# Altium schematic sheet esp32v4.SchDoc
size A2; SheetNumber: 2; SheetTotal: 2
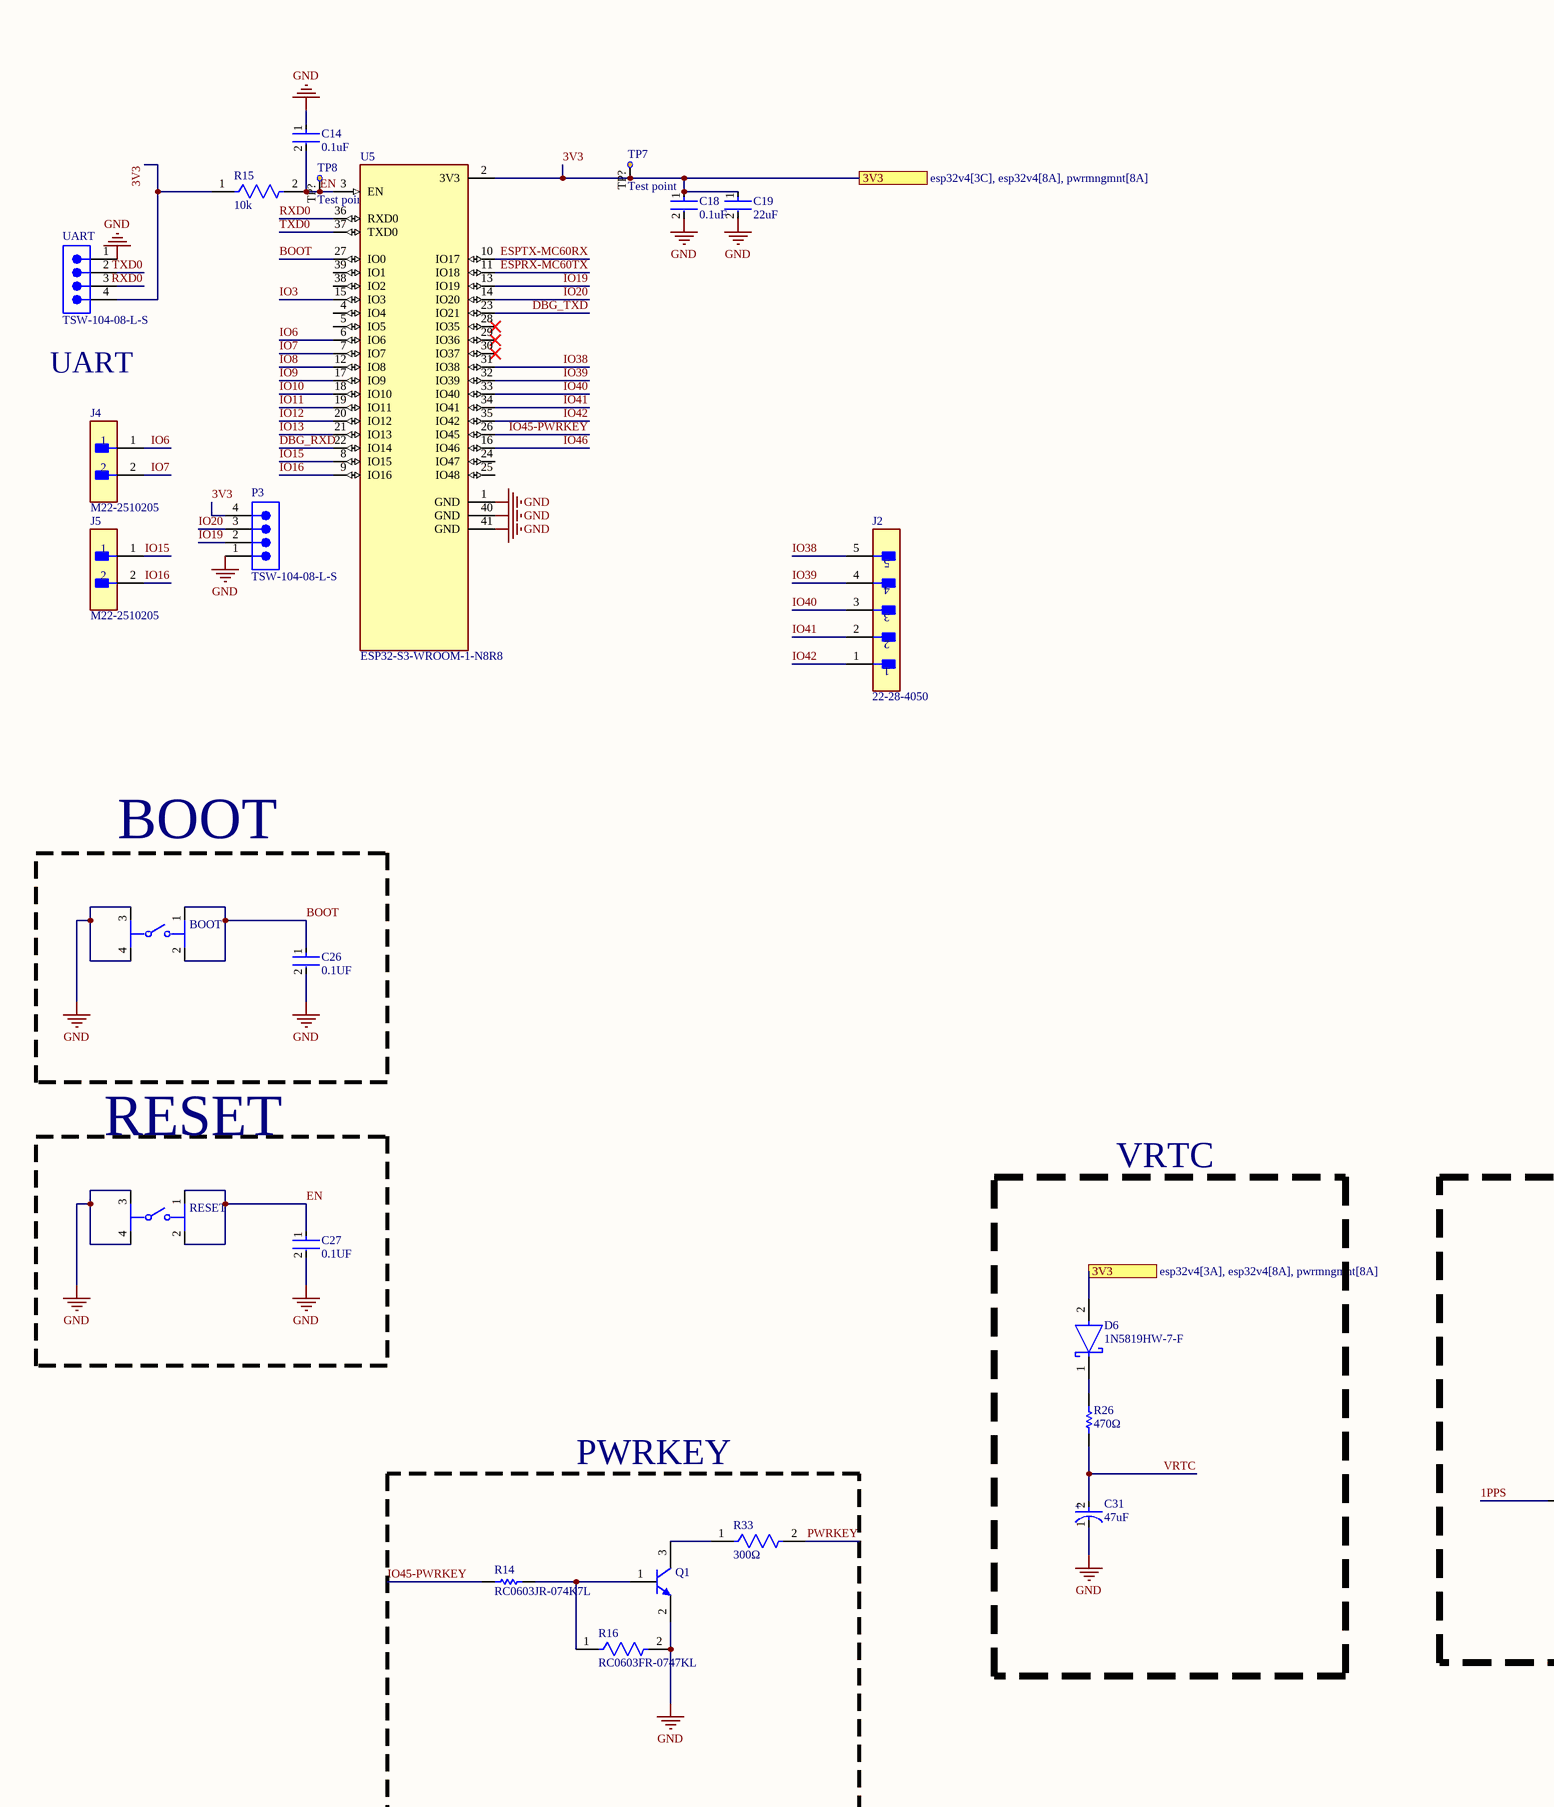
[diagram p0: esp32v4.SchDoc, left]
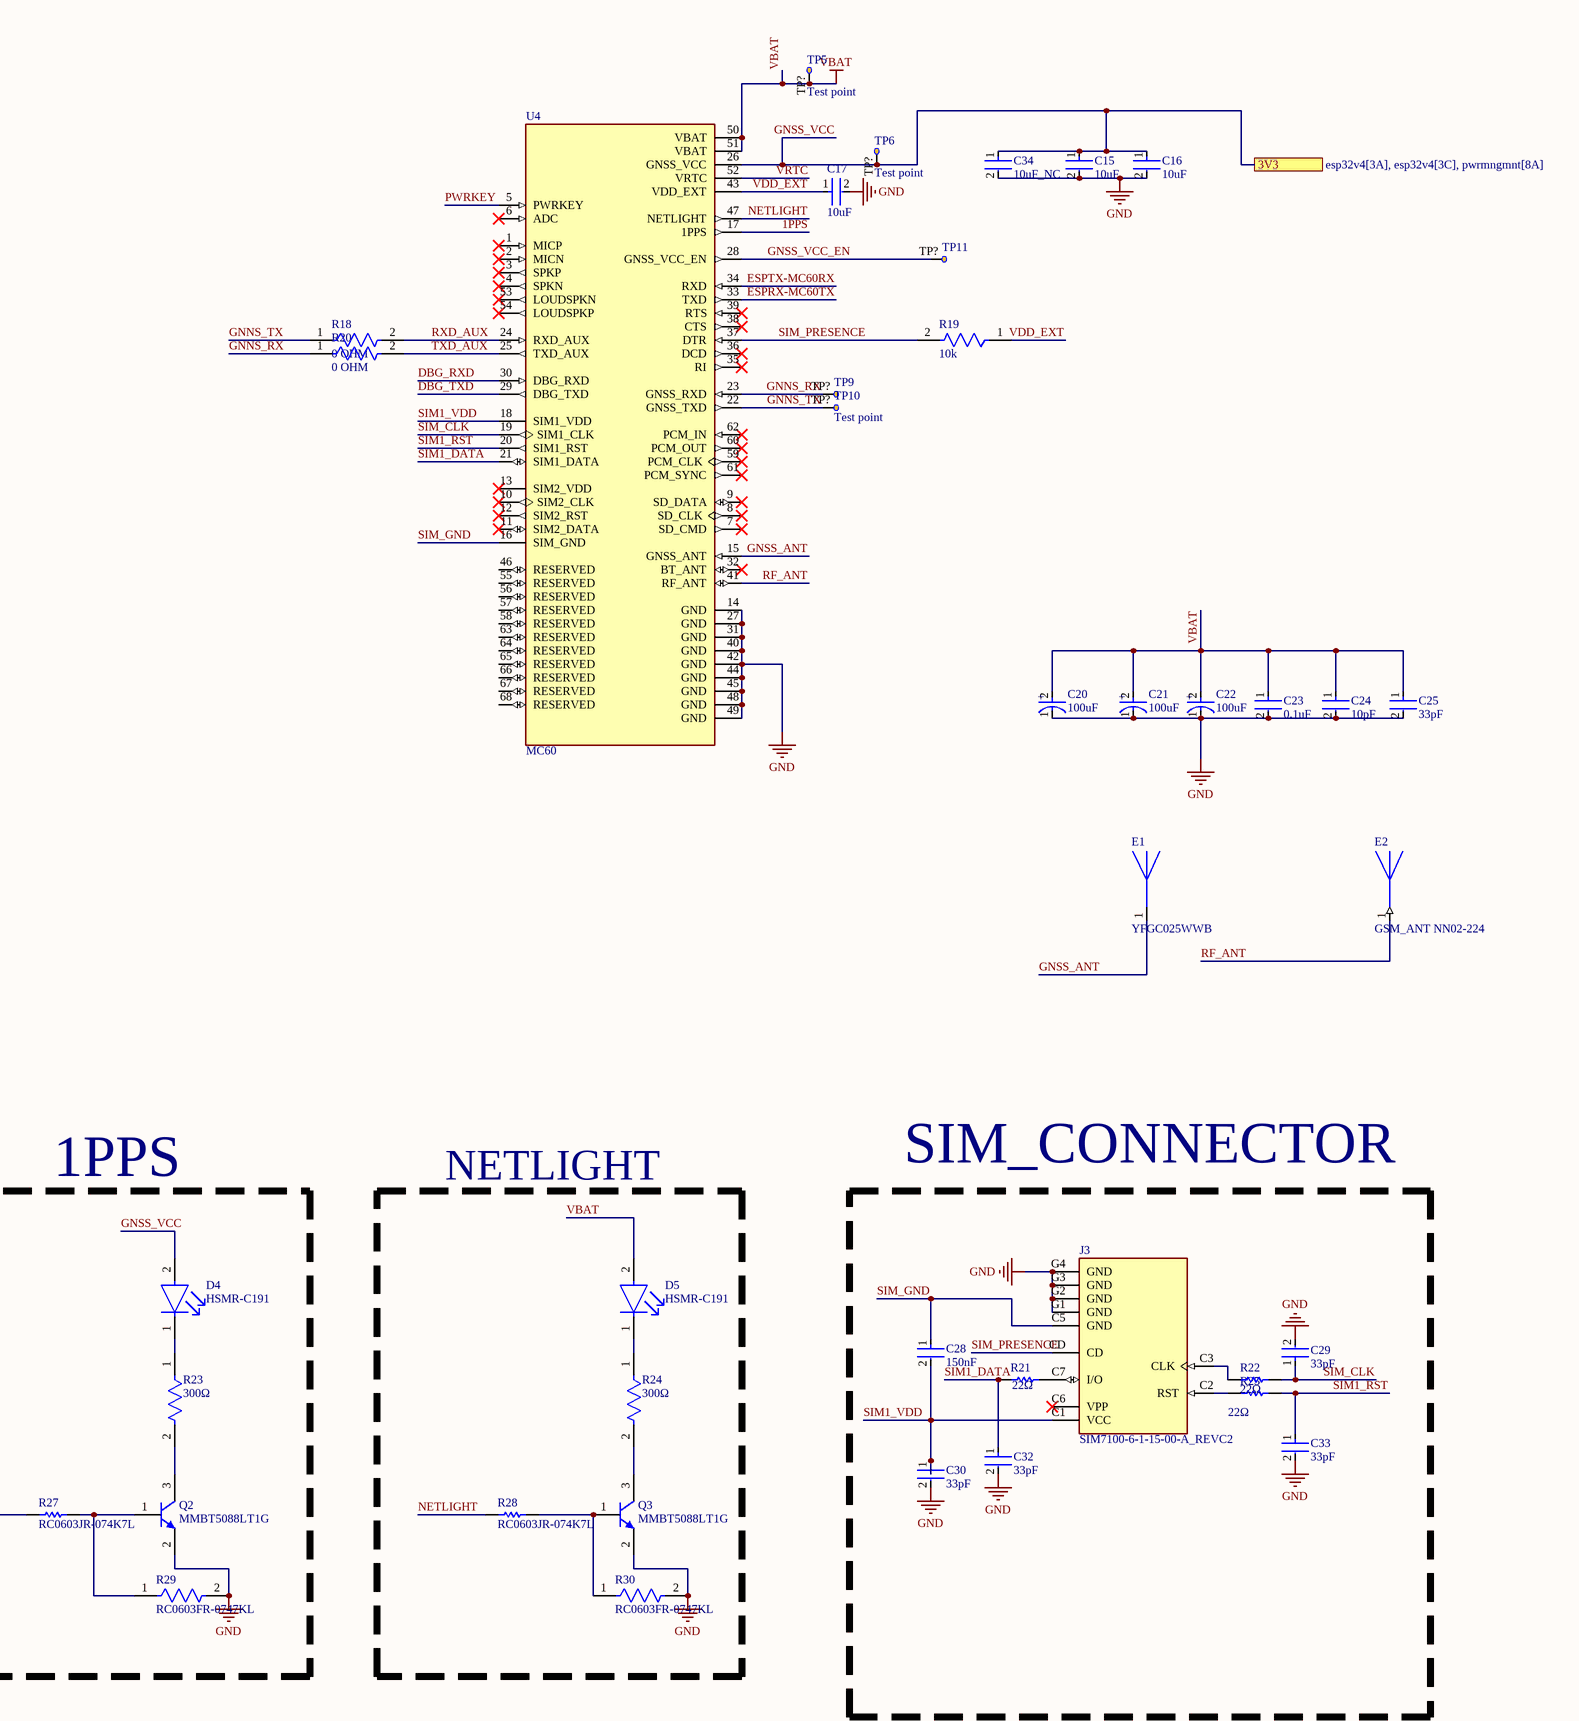
[diagram p1: esp32v4.SchDoc, right]

## Parts
BOOT  PTS810SJM250SMTRLFS  [FP-PTS810SJM250SMTRLFS-MFG]  (value not drawn)
C14  0.1uF  [FP-CC0805-0_85-MFG]
C15  10uF  [FP-C0805C106K4PACTU-MFG]
C16  10uF  [FP-CC0805-0_85-MFG]
C17  10uF  [FP-C0805C106K4PACTU-MFG]
C18  0.1uF  [FP-CC0805-0_85-MFG]
C19  22uF  [FP-GRM21B-0_15-MFG]
C20  100uF  [FP-SC-MFG]
C21  100uF  [FP-SC-MFG]
C22  100uF  [FP-SC-MFG]
C23  0.1uF  [FP-CC0805-0_85-MFG]
C24  10pF  [FP-C0805C-DN-MFG]
C25  33pF  [FP-C0603C-CF-MFG]
C26  0.1UF  [FP-CC0805-0_85-MFG]
C27  0.1UF  [FP-CC0805-0_85-MFG]
C28  150nF  [FP-CL21-IPC_C]
C29  33pF  [FP-0603-L_1_6_0_15-W_0_81-IPC_C]
C30  33pF  [FP-0603-L_1_6_0_15-W_0_81-IPC_C]
C31  47uF  [FP-OS-CON-SMT-C6-MFG]
C32  33pF  [FP-0603-L_1_6_0_15-W_0_81-IPC_C]
C33  33pF  [FP-0603-L_1_6_0_15-W_0_81-IPC_C]
C34  10uF_NC  [FP-C0805C106K4PACTU-MFG]
D4  HSMR-C191  [FP-HSMR-C191-MFG]
D5  HSMR-C191  [FP-HSMR-C191-MFG]
D6  1N5819HW-7-F  [FP-SOD123-IPC_A]
E1  YFGC025WWB  [XDCR_YFGC025WWB]
E2  GSM_ANT NN02-224  [XCVR_NN02-224]
J2  22-28-4050  [FP-22-28-4050-MFG]
J3  SIM7100-6-1-15-00-A_REVC2  [GCT_SIM7100-6-1-15-00-A_REVC2]
J4  M22-2510205  [FP-M22-2510205-MFG]
J5  M22-2510205  [FP-M22-2510205-MFG]
P3  TSW-104-08-L-S  [SMTC-TSW-104-08-X-S]
Q1  MMBT5088LT1G  [ONSC-SOT-23-3-318-08_V]  (value not drawn)
Q2  MMBT5088LT1G  [ONSC-SOT-23-3-318-08_V]
Q3  MMBT5088LT1G  [ONSC-SOT-23-3-318-08_V]
R14  RC0603JR-074K7L  [RESC1608X55X25ML10T15]
R15  10k  [FP-RT0805-MFG]
R16  RC0603FR-0747KL  [FP-RC0603FR-0747KL-MFG]
R18  0 OHM  [FP-RMCF0805-MFG]
R19  10k  [FP-RT0603-MFG]
R20  0 OHM  [FP-RMCF0805-MFG]
R21  22Ω  [RESC1005X40X25ML05T05]
R22  22Ω  [RESC1005X40X25ML05T05]
R23  300Ω  [FP-CRCW0603-e3-IPC_A]
R24  300Ω  [FP-CRCW0603-e3-IPC_A]
R25  22Ω  [RESC1005X40X25ML05T05]
R26  470Ω  [RESC3216X60X45ML10T20]
R27  RC0603JR-074K7L  [RESC1608X55X25ML10T15]
R28  RC0603JR-074K7L  [RESC1608X55X25ML10T15]
R29  RC0603FR-0747KL  [FP-RC0603FR-0747KL-MFG]
R30  RC0603FR-0747KL  [FP-RC0603FR-0747KL-MFG]
R33  300Ω  [FP-CRCW0603-e3-IPC_A]
RESET  PTS810SJM250SMTRLFS  [FP-PTS810SJM250SMTRLFS-MFG]  (value not drawn)
TP5  Test point  [Test_Point]
TP6  Test point  [Test_Point]
TP7  Test point  [Test_Point]
TP8  Test point  [Test_Point]
TP9  Test point  [Test_Point]  (value not drawn)
TP10  Test point  [Test_Point]
TP11  Test point  [Test_Point]  (value not drawn)
U4  MC60  [XCVR_MC60]
U5  ESP32-S3-WROOM-1-N8R8  [XCVR_ESP32S3WROOM1N8R8]
UART  TSW-104-08-L-S  [SMTC-TSW-104-08-X-S]

## Blocks framed on the sheet
BOOT: BOOT C26
RESET: C27 RESET
VRTC: C31 D6 R26
1PPS: D4 Q2 R23 R27 R29
NETLIGHT: D5 Q3 R24 R28 R30
SIM_CONNECTOR: C28-C30 C32 C33 J3 R21 R22 R25
PWRKEY: Q1 R14 R16 R33

## Ports
3V3 (see esp32v4[3A], esp32v4[3C], pwrmngmnt[8A]), 3V3 (see esp32v4[3A], esp32v4[8A], pwrmngmnt[8A]), 3V3 (see esp32v4[3C], esp32v4[8A], pwrmngmnt[8A])

## Nets
GND: BOOT.3 BOOT.4 C14.1 C15.2 C16.2 C17.2 C18.2 C19.2 C20.1(C) C21.1(C) C22.1(C) C23.2 C24.2 C25.2 C26.2 C27.2 C29.2 C30.2 C31.1(C) C32.2 C33.2 C34.2 J3.G1(GND) J3.G2(GND) J3.G3(GND) J3.G4(GND) P3.1 Q1.2(E) Q2.2(E) Q3.2(E) R16.2 R29.2 R30.2 RESET.3 RESET.4 U4.14(GND) U4.27(GND) U4.31(GND) U4.40(GND) U4.42(GND) U4.44(GND) U4.45(GND) U4.48(GND) U4.49(GND) U5.1(GND) U5.40(GND) U5.41(GND) UART.1
VBAT: C20.2(A) C21.2(A) C22.2(A) C23.1 C24.1 C25.1 D5.2(A) TP5.TP?(Test_point) U4.50(VBAT) U4.51(VBAT)
1PPS: R27.1 U4.17(1PPS)
3V3: C15.1 C16.1 C18.1 C19.1 C34.1 D4.2(A) D6.2(A) P3.4 R15.1 TP6.TP?(Test_point) TP7.TP?(Test_point) U4.26(GNSS_VCC) U5.2(3V3) UART.4 ; port 3V3  [also labelled GNSS_VCC]
BOOT: BOOT.1 BOOT.2 C26.1 U5.27(IO0)
DBG_RXD: U4.30(DBG_RXD) U5.22(IO14)
DBG_TXD: U4.29(DBG_TXD) U5.23(IO21)
EN: C14.2 C27.1 R15.2 RESET.1 RESET.2 TP8.TP?(Test_point) U5.3(EN)
ESPRX-MC60TX: U4.33(TXD) U5.11(IO18)
ESPTX-MC60RX: U4.34(RXD) U5.10(IO17)
GNNS_RX: R20.1 TP9.TP?(Test_point) U4.23(GNSS_RXD)
GNNS_TX: R18.1 TP10.TP?(Test_point) U4.22(GNSS_TXD)
GNSS_ANT: E1.1(FEED) U4.15(GNSS_ANT)
GNSS_VCC_EN: TP11.TP?(Test_point) U4.28(GNSS_VCC_EN)
IO3: U5.15(IO3)
IO6: J4.1 U5.6(IO6)
IO7: J4.2 U5.7(IO7)
IO8: U5.12(IO8)
IO9: U5.17(IO9)
IO10: U5.18(IO10)
IO11: U5.19(IO11)
IO12: U5.20(IO12)
IO13: U5.21(IO13)
IO15: J5.1 U5.8(IO15)
IO16: J5.2 U5.9(IO16)
IO19: P3.2 U5.13(IO19)
IO20: P3.3 U5.14(IO20)
IO38: J2.5 U5.31(IO38)
IO39: J2.4 U5.32(IO39)
IO40: J2.3 U5.33(IO40)
IO41: J2.2 U5.34(IO41)
IO42: J2.1 U5.35(IO42)
IO45-PWRKEY: R14.1 U5.26(IO45)
IO46: U5.16(IO46)
NETLIGHT: R28.1 U4.47(NETLIGHT)
PWRKEY: R33.2 U4.5(PWRKEY)
RF_ANT: E2.1(FEED) U4.41(RF_ANT)
RXD0: U5.36(RXD0) UART.3
RXD_AUX: R18.2 U4.24(RXD_AUX)
SIM1_DATA: C32.1 R21.1 U4.21(SIM1_DATA)
SIM1_RST: C33.1 R25.2 U4.20(SIM1_RST)
SIM1_VDD: C28.2 C30.1 J3.C1(VCC) U4.18(SIM1_VDD)
SIM_CLK: C29.1 R22.2 U4.19(SIM1_CLK)
SIM_GND: C28.1 J3.C5(GND) U4.16(SIM_GND)
SIM_PRESENCE: J3.CD R19.2 U4.37(DTR)
TXD0: U5.37(TXD0) UART.2
TXD_AUX: R20.2 U4.25(TXD_AUX)
VDD_EXT: C17.1 R19.1 U4.43(VDD_EXT)
VRTC: C31.2(A) R26.2 U4.52(VRTC)
NetD4_1: D4.1(C) R23.1
NetD5_1: D5.1(C) R24.1
NetD6_1: D6.1(C) R26.1
NetJ3_C2: J3.C2(RST) R25.1
NetJ3_C3: J3.C3(CLK) R22.1
NetJ3_C7: J3.C7(I/O) R21.2
NetQ1_1: Q1.1(B) R14.2 R16.1
NetQ1_3: Q1.3(C) R33.1
NetQ2_1: Q2.1(B) R27.2 R29.1
NetQ2_3: Q2.3(C) R23.2
NetQ3_1: Q3.1(B) R28.2 R30.1
NetQ3_3: Q3.3(C) R24.2

Not connected (* = marked no-connect by the designer): J3 C6(VPP)*; U4 1(MICP)* 2(MICN)* 3(SPKP)* 4(SPKN)* 6(ADC)* 7(SD_CMD)* 8(SD_CLK)* 9(SD_DATA)* 10(SIM2_CLK)* 11(SIM2_DATA)* 12(SIM2_RST)* 13(SIM2_VDD)* 32(BT_ANT)* 35(RI)* 36(DCD)* 38(CTS)* 39(RTS)* 46(RESERVED) 53(LOUDSPKN)* 54(LOUDSPKP)* 55(RESERVED) 56(RESERVED) 57(RESERVED) 58(RESERVED) 59(PCM_CLK)* 60(PCM_OUT)* 61(PCM_SYNC)* 62(PCM_IN)* 63(RESERVED) 64(RESERVED) 65(RESERVED) 66(RESERVED) 67(RESERVED) 68(RESERVED); U5 4(IO4) 5(IO5) 24(IO47) 25(IO48) 28(IO35)* 29(IO36)* 30(IO37)* 38(IO2) 39(IO1)

## Notes on the sheet
- UART
- (in symbol CMP-05427-000047-1) +
- (in symbol CMP-05428-000959-1) +

## Library data of the parts
BOOT RESET = CMP-10040-000001-2: SWITCH TACTILE SPST-NO 0.05A 16V; Throw Configuration: SPST; Operating Force: 160gf; Actuator Type: Standard; Switch Travel: 0.15mm; Switch Function: Off-Mom; Max Current Rating: 50mA; Mechanical Life: 150000Cycles; Illumination Type: Non-Illuminated; Package Quantity: 2900; Depth: 4.6mm; Mount: Surface Mount; Packaging: Tape and Reel; Length: 3.2mm; RoHS Compliant: Yes; Case/Package: SMD/SMT; Voltage Rating (DC): 16V; Min Operating Temperature: -40°C; Termination: J-Bend; Lead Free: Lead Free; Contact Plating: Silver; Orientation: Straight; Max Operating Temperature: 85°C; Current Rating: 50mA; Color: Black
C14 C26 C27 = CMP-2100-03606-3: CAP CER 0.1UF 50V X7R 0805; Manufacturer Part Number: CC0805KRX7R9BB104; Manufacturer: Yageo; Tolerance: 0.1; Capacitance: 100 nF; Value: 100 nF; Material: Ceramic; Device Class L1: Passive Components; ComponentLink2Description: Datasheet; Package: CC0805-0.85; Digikey Description: CAP CER 0.1UF 50V X7R 0805; Device Class L3: Ceramic Capacitors; Temperature: -30°C to +85°C; Temperature Characteristic: X7R; Voltage Rating: 50 V; Height: 0.95mm; RoHS: TRUE; Ipc Land Pattern Name: CAPC200125X85; Device Class L2: Capacitors; Category: Cap; Temperature Range Low: -30°C; Temperature Range High: +85°C; Mouser Description: Multilayer Ceramic Capacitors MLCC - SMD/SMT 100nF 50V X7R 10%; Footprint Url: http://www.yageo.com/exep/pages/download/literatures/UPY-C_GEN_24.pdf; Automotive: No; Octopart: https://octopart.com/cc0805krx7r9bb104-yageo-192993; Lead Free: Yes; ComponentLink2URL: http://www.yageo.com/documents/recent/UPY-GPHC_Y5V_6.3V-to-50V_8.pdf
C15 C17 C34 = CMP-03020-034671-1: CAP CER 10UF 16V X5R 0805; Dissipation Factor: 5%; Tolerance: 10%; Dielectric Material: Ceramic; REACH SVHC: No SVHC; Packaging: Tape and Reel; Series: C; Min Operating Temperature: -55°C; Construction: Flat; Radiation Hardening: No; Case Code (Metric): 2012; Contact Plating: Tin; Case Code (Imperial): 0805; Voltage Rating: 16V; Mount: Surface Mount; Width: 0.049inch; Voltage: 16V; Dielectric: X5R; Height: 1.25mm; Depth: 1.25mm; Case/Package: 0805; Max Operating Temperature: 85°C; Length: 2mm; Thickness: 0.055inch; Termination: SMD/SMT; Capacitance: 10uF; Number of Pins: 2; Voltage Rating (DC): 16V; Lead Free: Lead Free; Package Quantity: 1
C16 C18 C23 = CMP-1036-04410-2: CAP CER 0.1UF 25V X7R 0805; Manufacturer Part Number: CC0805KRX7R8BB104; Manufacturer: Yageo; Tolerance: 0.1; Material: Ceramic; Value: 100 nF; ComponentLink2URL: http://www.yageo.com/documents/recent/UPY-GPHC_Y5V_6.3V-to-50V_8.pdf; Category: Cap; Mouser Description: Multilayer Ceramic Capacitors MLCC - SMD/SMT 100nF 25V X7R 10%; Device Class L1: Passive Components; Footprint Url: http://www.yageo.com/exep/pages/download/literatures/UPY-C_GEN_24.pdf; Height: 0.95mm; Digikey Description: CAP CER 0.1UF 25V X7R 0805; Lead Free: Yes; Temperature Range High: +85°C; Temperature: -30°C to +85°C; Ipc Land Pattern Name: CAPC200125X85; Capacitance: 100 nF; Automotive: No; Octopart: https://octopart.com/cc0805krx7r8bb104-yageo-39467766; Device Class L2: Capacitors; Temperature Characteristic: X7R; Voltage Rating: 25 V; ComponentLink2Description: Datasheet; Temperature Range Low: -30°C; Device Class L3: Ceramic Capacitors; RoHS: TRUE; Package: CC0805-0.85
C19 = CMP-2007-03385-2: Chip Multilayer Ceramic Capacitors for General Purpose, 0805, 22uF, X5R, 15%, 20%, 6.3V; Material: Ceramic; Max Operating Temperature: 85°C; Voltage: 6.3V; Min Operating Temperature: -55°C; Case/Package: 0805; Thickness: 0.053inch; Dielectric: X5R; Packaging: Tape and Reel; Depth: 1.25mm; Termination: SMD/SMT; Voltage Rating (DC): 6.3V; Radiation Hardening: No; Tolerance: 20%; Mount: Surface Mount; Lead Free: Lead Free; Package Quantity: 1; REACH SVHC: No SVHC; Voltage Rating: 6.3V; Capacitance: 22uF; Length: 2mm; Case Code (Imperial): 0805; Case Code (Metric): 2012; Width: 0.049inch; Height: 1.25mm
C20-C22 = CMP-05427-000047-1: CAP ALUM 100UF 20% 10V SMD; Life (Hours): 1000Hour; Ripple Current: 50mA; Packaging: Tape and Reel; Diameter: 5mm; Voltage Rating (DC): 10V; Mount: Surface Mount; Max Operating Temperature: 85°C; Length: 5.5mm; Case/Package: Radial; Height: 5.4mm; Construction: Cylindrical; Termination: SMD/SMT; Height - Seated (Max): 0.213inch; Series: S; Min Operating Temperature: -40°C; Capacitance: 100uF; Tolerance: 20%; Voltage Rating: 10V; Package Quantity: 1; Radiation Hardening: No; Ripple Current (AC): 50mA; Lead Free: Lead Free; RoHS Compliant: Yes; Contact Plating: Tin
C24 = CMP-1036-00875-3: Cap Ceramic 10pF 100V C0G 5% SMD 0805 125C Plastic T/R; Manufacturer Part Number: C0805C100J1GACTU; Manufacturer: KEMET; Temperature Coefficient: 30ppm/°C; Tolerance: 0.05; Capacitance: 10 pF; Category: Cap; Height: 0.88mm; Temperature: -55°C to +125°C; Device Class L2: Capacitors; Temperature Characteristic: C0G; Lead Free: Yes; RoHS: TRUE; Octopart: https://octopart.com/c0805c100j1gactu-kemet-127179; Temperature Range Low: -55°C; Device Class L3: Ceramic Capacitors; Device Class L1: Passive Components; Temperature Range High: +125°C; Material: Ceramic; Package: C0805C-DN; Mouser Description: Multilayer Ceramic Capacitors MLCC - SMD/SMT 100volts 10pF C0G 5%; Ipc Land Pattern Name: CAPC200125X78; Voltage Rating: 100 V; Value: 10 pF; ComponentLink2URL: https://content.kemet.com/datasheets/KEM_C1003_C0G_SMD.pdf; Automotive: No; ComponentLink2Description: Datasheet; Digikey Description: Cap Ceramic 10pF 100V C0G 5% SMD 0805 125C Plastic T/R
C25 = CMP-2006-03168-3: Capacitor; Ceramic; Cap; 33.0pF; Tol 5%; SMT; Vol-Rtg 50V; C0G; Tape and Reel; Manufacturer Part Number: C0603C330J5GACTU; Manufacturer: KEMET; Tolerance: 0.05; Temperature Coefficient: 30ppm/°C; Automotive Grade: Grade 1; Height: 0.87mm; Digikey Description: Capacitor; Ceramic; Cap; 33.0pF; Tol 5%; SMT; Vol-Rtg 50V; C0G; Tape and Reel; Value: 33 pF; Material: Ceramic; RoHS: TRUE; Device Class L1: Passive Components; Temperature Characteristic: C0G; Capacitance: 33 pF; Voltage Rating: 50 V; Automotive: Yes; Temperature Range High: +125°C; ComponentLink2Description: Datasheet; ComponentLink2URL: https://api.kemet.com/component-edge/download/datasheet/C0603C100J5GACAUTO.pdf; Category: Cap; Mouser Description: Capacitor; Ceramic; Cap; 33.0pF; Tol 5%; SMT; Vol-Rtg 50V; C0G; Tape and Reel; Temperature Range Low: -55°C; Octopart: https://octopart.com/c0603c330j5gactu-kemet-87666; Temperature: -55°C to +125°C; Lead Free: Yes; Device Class L3: Ceramic Capacitors; Package: C0603C-CF; Device Class L2: Capacitors
C28 = CMP-13271-002648-1: CL21 Series 0805 150nF 16V ±10% Tolerance X7R Multilayer Ceramic Chip Capacitor; Max Operating Temperature: 125°C; Depth: 1.25mm; Height: 0.65mm; Tolerance: 10%; Case/Package: 0805; Width: 0.049inch; Packaging: Tape and Reel; Case Code (Metric): 2012; Thickness: 0.03inch; Min Operating Temperature: -55°C; Radiation Hardening: No; Mount: Surface Mount; Case Code (Imperial): 0805; Voltage Rating (DC): 16V; Dielectric: X7R; Capacitance: 150nF; Length: 2mm; Voltage Rating: 16V; Package Quantity: 1
C29 C30 C32 C33 = CMP-04427-014896-1: General Purpose Ceramic Capacitor, 0603, 33pF, 5%, NP0, 30ppm/°C, 50V; Dielectric: C0G; Insulation Resistance: 100GR; Max Operating Temperature: 125°C; REACH SVHC: No SVHC; Min Operating Temperature: -55°C; Tolerance: 5%; RoHS Compliant: Yes; Voltage Rating (DC): 50V; Case Code (Imperial): 0603; Termination: SMD/SMT; Lead Free: Lead Free; Thickness: 0.034inch; Dielectric Material: Ceramic; Mount: Surface Mount; Voltage: 50V; Packaging: Tape and Reel; Temperature Coefficient: 30ppm/°C; Height: 0.63mm; Depth: 0.81mm; Case Code (Metric): 1608; Width: 0.81mm; Length: 1.6mm; Radiation Hardening: No; Package Quantity: 4000; Contact Plating: Tin; Capacitance: 33pF; Voltage Rating: 50V; Number of Pins: 2; Case/Package: 0603
C31 = CMP-05428-000959-1: Conductive Polymer Aluminum Solid Capacitors (OS-CON) 47uF ±20% 10V; Life (Hours): 2000Hour; Ripple Current (AC): 1.62A; Leakage Current: 94uA; Polarity: Polar; ESR (Equivalent Series Resistance): 50mR; Dissipation Factor: 12%; Length: 5.9mm; Tolerance: 20%; Min Operating Temperature: -55°C; Voltage Rating: 10V; Mount: Surface Mount; Capacitance: 47uF; Series: OS-CON™, SVP; Case/Package: Radial; Package Quantity: 1000; Voltage Rating (DC): 10V; Voltage: 10V; Max Operating Temperature: 105°C; Diameter: 6.3mm; Material: Polymer; Packaging: Tape and Reel; Termination: SMD/SMT; Number of Pins: 6; Height: 5.9mm; Lead Free: Lead Free; Height - Seated (Max): 0.236inch; RoHS Compliant: Yes; Construction: Cylindrical; REACH SVHC: No SVHC; Ripple Current: 1.62A
D4 D5 = CMP-02129-71131536-1: HSMR-C191 High-Performance Chip LED Single Color LED, Blue, Untinted Diffused, 1mm; Power Dissipation: 78mW; Luminous Flux: 88lm; Number of Elements: 1; Test Current: 20mA; Forward Voltage: 3.4V; Wavelength: 473nm; Lens Color: Clear, White; Reverse Voltage: 5V; Viewing Angle: 140°; Luminous Intensity: 55mcd; Max Junction Temperature (Tj): 95°C; Peak Wavelength: 469nm; Case/Package: 0603; Mount: Surface Mount; Schedule B: 8541402000; Number of LEDs: 1; Min Operating Temperature: -40°C; Power Rating: 78mW; Case Code (Metric): 1608; Length: 1.6mm; Radiation Hardening: No; Dominant Wavelength: 473nm; Color: Blue; Width: 800µm; Lead Free: Lead Free; Illumination Color: Blue; Depth: 800µm; Height: 600µm; NexarPartId: 71131536; Case Code (Imperial): 0603; Number of Pins: 2; RoHS: Compliant; Max Operating Temperature: 85°C; Lens Transparency: Diffused; Packaging: Tape and Reel; Max Power Dissipation: 78mW; Lens Style: Diffused; Contact Plating: Gold; REACH SVHC: No SVHC; Forward Current: 20mA
D6 = CMP-0303-00003-3: DIODE SCHOTTKY 40V 1A SOD123; Forward Voltage: 450mV; Capacitance: 110pF; Max Forward Surge Current (Ifsm): 25A; Peak Reverse Current: 50uA; Polarity: Standard; Element Configuration: Single; Max Power Dissipation: 450mW; Min Operating Temperature: -65°C; Package Quantity: 3000; Contact Plating: Tin; Weight: 0.000353oz; Max Repetitive Reverse Voltage (Vrrm): 40V; Max Reverse Voltage (DC): 40V; Height: 1.25mm; Average Rectified Current: 1A; Width: 1.7mm; Case/Package: SOD-123-2; Lead Free: Lead Free; Max Operating Temperature: 125°C; Current Rating: 1A; Termination: SMD/SMT; Forward Current: 1A; Radiation Hardening: No; Number of Pins: 2; Length: 2.85mm; Voltage Rating (DC): 40V; REACH SVHC: No SVHC; Peak Non-Repetitive Surge Current: 25A; Packaging: Tape and Reel; Output Current: 1A
E2 = NN02-224: Ultra-compact form antenna booster for GSM, UMTS, 4G, GNSS, Bluetooth, Wi-Fi Dual Band (824 - 960MHz, 1710 - 2690MHz, 1561 - 1606MHz, 2400 - 2500MHz and 4900 - 5875MHz), signal booster; MF: Ignion; SnapEDA_Link: https://www.snapeda.com/parts/NN02-224/Ignion/view-part/?ref=snap; Package: SMD Ignion; Value: *; MP: NN02-224; Check_prices: https://www.snapeda.com/parts/NN02-224/Ignion/view-part/?ref=eda
J2 = CMP-00257-00278173-1: 22-28-4050 KK® 254 Breakaway Header, Vertical, 5 Circuits, Tin (Sn) Plating, Mating Pin Length 6.09mm; NexarPartId: 278173; Voltage Rating: 250V; Number of Contacts: 5; Contact Resistance: 20mΩ; Gender: Male; Pitch: 2.54mm; Connector Type: Male Pin; Current Rating: 4A; Glow Wire Compliant: Non-compliant; Max Voltage Rating (DC): 250.25kV; Flammability Rating: UL94 V-0; Min Operating Temperature: 0°C; REACH SVHC: Unknown; Lead Free: Lead Free; Termination: Solder; RoHS: Compliant; Schedule B: 8536694040; Number of Circuits: 5; Mount: Through Hole; Lead Pitch: 2.54mm; Height: 2.29mm; Voltage Rating (DC): 250V; Max Operating Temperature: 75°C; Width: 2.49mm; Radiation Hardening: No; Contact Plating: Tin; Orientation: Vertical; Length: 12.7mm; Number of Rows: 1; Housing Material: Thermoplastic; Contact Material: Brass; Packaging: Bulk; Contact Mating Length: 6.096mm; Housing Color: Black; Color: Black; Number of Positions: 5
J3 = SIM7100-6-1-15-00-A_REVC2: 7 (6 + 1) Position Card Connector Micro SIM Surface Mount, Right Angle Gold; MF: Global Connector Technology; SnapEDA_Link: https://www.snapeda.com/parts/SIM7100-6-1-15-00-A/Global+Connector+Technology/view-part/?ref=snap; Package: None; Value: *; MP: SIM7100-6-1-15-00-A; Check_prices: https://www.snapeda.com/parts/SIM7100-6-1-15-00-A/Global+Connector+Technology/view-part/?ref=eda
J4 J5 = CMP-15831-000005-1: CONN HEADER VERT 2POS 2MM; Manufacturer: Harwin; Conn Gender: Male; Current Rating: 2A; Number Of Contacts: 2; Conn Orientation: Vertical; Temperature Range Low: -40°C; Device Class L1: Connectors; ComponentLink2URL: https://cdn.harwin.com/pdfs/C018XX_M22_Series_Connectors.pdf; Temperature Range High: +105°C; Pitch: 2mm; Number Of Rows: 1; Temperature: -40°C to +105°C; Automotive: No; Device Class L3: unset; Octopart: https://octopart.com/m22-2510205-harwin-2538221; Mouser Description: Headers & Wire Housings 2 PIN SIL VERTICAL GOLD PIN HEADER; Height: 5.45mm; Category: Conn; Digikey Description: CONN HEADER VERT 2POS 2MM; Contact Material: Gold,Nickel; Lead Free: Yes; ComponentLink2Description: Datasheet; Manufacturer Part Number: M22-2510205; Device Class L2: Headers and Wire Housings; Package: 0; Footprint Url: https://cdn.harwin.com/pdfs/M22-251.pdf; RoHS: TRUE
P3 UART = CMP-1024-00358-1: 0.025" SQ Post Header, Through-hole, Vertical, -55 to 125 degC, 2.54 mm Pitch, 4-Pin, Male, RoHS; Manufacturer: Samtec; Pitch: 2.54 mm; PartNumber: TSW-104-08-L-S; RoHS: True; Temperature Range: -55 to 125 degC; PackageDescription: .025[0.64] SQ. Post Terminal Strip Assembly; Orientation: Vertical; ComponentLink2URL: http://www.samtec.com/documents/webfiles/pdf/TSW_TH.PDF; ComponentLink1Description: Manufacturer URL; ComponentLink2Description: Datasheet; PackageVersion: DM, 8/1988; ComponentLink3URL: http://www.samtec.com/documents/webfiles/cpdf/TSW-XXX-XX-XXX-X-XX-XXX-MKT.pdf; Mounting Technology: Through-hole; PackageReference: TSW-104-08-X-S; ComponentLink3Description: Package Specification; ComponentLink1URL: http://www.samtec.com; DatasheetVersion: F-214
Q1-Q3 = CMP-1048-00558-1: Low Noise Transistor, NPN Silicon, 3-Pin SOT-23, Pb-Free, Tape and Reel; Manufacturer: On Semiconductor; IC Continuous (A): 0.05; fT Min (MHz): 50; PartNumber: MMBT5088LT1G; PackageDescription: 3-Pin Small Outline Transistor, Body 2.92 x 1.3 mm, Pitch 0.95 mm; RoHS: TRUE; ComponentLink2URL: http://www.onsemi.cn/pub_link/Collateral/MMBT5088LT1-D.PDF; PackageVersion: Rev. AP, 11/2009; Mounting Technology: Surface Mount; Packing: Tape and Reel; ComponentLink1URL: http://www.onsemi.com/; PackageReference: SOT-23-3-318-08; ComponentLink2Description: Datasheet; ComponentLink1Description: Manufacturer URL; DatasheetVersion: Rev. 4; Polarity: NPN; ComponentLink3Description: Package Specification; ComponentLink3URL: http://www.onsemi.cn/pub_link/Collateral/318-08.PDF
R14 R27 R28 = CMP-2000-05024-1: Chip Resistor, 4.7 KOhm, +/- 5%, 100 mW, -55 to 155 degC, 0603 (1608 Metric), RoHS, Tape and Reel; Manufacturer: Yageo; Resistance: 4.7kOhms; Temperature Coefficient: 100PPM/C; Power Rating: 100mW; Voltage Rating: 50V; Operating Temperature Range: -55Cto+155C; Case Code - mm: 1608; Tolerance: 5%; Product: ThickFilmResistorsGeneralPurpose; Case Code - in: 0603; Datasheet URL: http://www.yageo.com/documents/recent/PYu-RC_Group_51_RoHS_L_04.pdf; Package Reference: 603; Datasheet Version: Rev. 4, 02/2016; Package Description: 2-Pin Surface Mount Device, Body 1.6 x 0.8 mm; Manufacturer URL: http://www.yageo.com/; Series: RC; Packaging: Reel; Termination Style: SMD/SMT
R15 = CMP-03412-034151-1: RES SMD 10K OHM 0.1% 1/8W 0805; Manufacturer: Yageo; Manufacturer Part Number: RT0805BRD0710KL; Voltage Rating: 150V; Tolerance: 0.0025; Resistance: 10KΩ; Temperature Coefficient: 25 ppm/°C; Power Rating: 0.125W; Value: 10KΩ; Composition: Thin Film; Device Class L3: Chip SMD Resistors; Octopart: https://octopart.com/rt0805brd0710kl-yageo-1290190; Ipc Land Pattern Name: RESC200125X50; Series: RT; Device Class L1: Passive Components; Lead Free: Yes; Device Class L2: Resistors; RoHS: TRUE; Height: 0.6mm; Temperature Range Low: -55°C; Category: Res; Mouser Description: Thin Film Resistors - SMD 10K OHM .1% 25PPM; Temperature: -55°C to +155°C; Package: RT0805; Footprint Url: http://www.yageo.com/exep/pages/download/literatures/PYu-R_Mount_10.pdf; Automotive: No; Digikey Description: RES SMD 10K OHM 0.1% 1/8W 0805; Temperature Range High: +155°C; ComponentLink2Description: Datasheet; ComponentLink2URL: http://www.yageo.com/documents/recent/PYu-RT_1-to-0.01_RoHS_L_9.pdf
R16 R29 R30 = CMP-1659-00055-2: RES SMD 47K OHM 1% 1/10W 0603; Voltage Rating: 50V; Temperature Coefficient: 100ppm/°C; Max Power Dissipation: 100mW; Resistance: 47kR; Voltage Rating (DC): 50V; Min Operating Temperature: -55°C; Packaging: Tape and Reel; Features: Moisture Resistant; Termination: SMD/SMT; Technology: THICK FILM; Lead Free: Lead Free; Max Operating Temperature: 155°C; Width: 0.031inch; Case Code (Metric): 1608; Tolerance: 1%; Package Quantity: 1; Resistor Type: Thick Film; RoHS Compliant: Yes; Case/Package: 0603; Case Code (Imperial): 0603; Resistance Tolerance: 1%; Length: 0.063inch; Series: RC; Number of Pins: 2; Power Rating: 100mW; Number of Terminations: 2; Construction: Rectangular; Height: 0.022inch; Military Standard: Not; Size Code: 0603; Depth: 0.8mm
R18 R20 = CMP-26527-000017-1: RES 0 OHM JUMPER 1/8W 0805; Power Rating: 125mW; Resistance: 0mR; Depth: 1.25mm; Length: 2mm; Military Standard: Not; Width: 0.049inch; Case Code (Imperial): 0805; Number of Terminations: 2; Mount: Surface Mount; Contact Plating: Tin; Height: 0.026inch; Case/Package: 0805; Min Operating Temperature: -55°C; Composition: Thick Film; Max Operating Temperature: 155°C; Packaging: Tape and Reel; Features: Automotive AEC-Q200; Max Power Dissipation: 125mW; Radiation Hardening: No; Lead Free: Lead Free; Case Code (Metric): 2012
R19 = CMP-03412-005349-1: RES SMD 10K OHM 1% 1/10W 0603; Manufacturer: Yageo; Manufacturer Part Number: RT0603FRE0710KL; Value: 10KΩ; Temperature Coefficient: 50 ppm/°C; Power Rating: 0.1W; Tolerance: 0.01; Voltage Rating: 75V; RoHS: TRUE; Category: Res; Automotive: No; Digikey Description: RES SMD 10K OHM 1% 1/10W 0603; ComponentLink2Description: Datasheet; Octopart: https://octopart.com/rt0603fre0710kl-yageo-40009243; ComponentLink2URL: http://www.yageo.com/documents/recent/PYu-RT_1-to-0.01_RoHS_L_9.pdf; Device Class L3: Chip SMD Resistors; Device Class L1: Passive Components; Temperature Range High: +155°C; Height: 0.55mm; Composition: Thin Film; Ipc Land Pattern Name: RESC16080X45; Series: RT; Package: RT0603; Resistance: 10KΩ; Footprint Url: http://www.yageo.com/exep/pages/download/literatures/PYu-R_Mount_10.pdf; Temperature: -55°C to +155°C; Temperature Range Low: -55°C; Lead Free: Yes; Device Class L2: Resistors; Mouser Description: Thin Film Resistors - SMD 10K ohm 1% 1/10W
R21 R22 R25 = CMP-2002-01135-4: Chip Resistor, 22 Ohm, +/- 1%, 0.1 W, -55 to 155 degC, 0402 (1005 Metric), RoHS, Tape and Reel; PartNumber: ERJ-2RKF22R0X; Case\/Package: 0402; Resistance: 22 Ohm; Power Rating: 100 mW; Voltage Rating: 50 V; ComponentLink2Description: Datasheet; Packaging: Tape and Reel; Weight: 2.8E-05oz; Pins: 2; Case Code (Imperial): 0402; Width: 0.5 mm; ComponentLink2URL: http://industrial.panasonic.com/cdbs/www-data/pdf/RDA0000/AOA0000C86.pdf; Height: 0.35 mm; PackageReference: 0402; REACH SVHC: Yes; Min Operating Temperature: -55 degC; Length: 1 mm; DatasheetVersion: 04/2015; RoHSCompliant: true; Package Quantity: 10000; Case Code (Metric): 1005; PackageDescription: 2-Pin Surface Mount Device, Body 1 x 0.5 mm; ComponentLink1URL: http://www.panasonic.com/; Mount: Surface Mount; Mounting Technology: Surface Mount; Tolerance: 1%; Max Operating Temperature: 155 degC; ComponentLink1Description: Manufacturer URL
R23 R24 R33 = CMP-2000-03216-2: RES Thick Film, 300Ω, 1%, 0.1W, 100ppm/°C, 0603; Voltage Rating (DC): 75V; Power Rating: 100mW; Resistance: 300R; Length: 1.55mm; Height: 0.45mm; Case/Package: 0603; Temperature Coefficient: 100ppm/°C; Packaging: Tape and Reel; Termination: SMD/SMT; Depth: 0.85mm; Max Operating Temperature: 155°C; Radiation Hardening: No; Tolerance: 1%; Lead Free: Lead Free; Case Code (Metric): 1608; Voltage Rating: 75V; Weight: 7.1E-05oz; Package Quantity: 10; Military Standard: Not; Case Code (Imperial): 0603; Composition: Thick Film; Min Operating Temperature: -55°C; Width: 0.033inch; Number of Terminations: 2; Mount: Surface Mount; Features: Automotive AEC-Q200; Contact Plating: Tin; Max Power Dissipation: 100mW
R26 = CMP-2003-02206-1: Manufacturer: Vishay Dale; Part Number: CRCW1206470RFKEA
TP5-TP11 = Test_Point: Value: Test point
U4 = MC60: Quad-band GSM/GPRS/GNSS module; 18.7mm 16.0mm 2.1mm; Max. data rate: 85.6Kbps; SMT form factor; LCC castellation packaging; Extended temperature range of -40C to +85C.; MF: Quectel; SnapEDA_Link: https://www.snapeda.com/parts/MC60/Quectel/view-part/?ref=snap; Package: Custom Quectel; Value: *; MP: MC60; Check_prices: https://www.snapeda.com/parts/MC60/Quectel/view-part/?ref=eda
U5 = ESP32-S3-WROOM-1-N8R8: Bluetooth, WiFi 802.11b/g/n, Bluetooth v5.0 Transceiver Module 2.4GHz PCB Trace Surface Mount; MF: Espressif Systems; Package: None; Price: None; Check_prices: https://www.snapeda.com/parts/ESP32-S3-WROOM-1-N8R8/Espressif+Systems/view-part/?ref=eda; Value: *; SnapEDA_Link: https://www.snapeda.com/parts/ESP32-S3-WROOM-1-N8R8/Espressif+Systems/view-part/?ref=snap; MP: ESP32-S3-WROOM-1-N8R8; Availability: In Stock; Purchase-URL: https://pricing.snapeda.com/search?q=ESP32-S3-WROOM-1-N8R8&ref=eda
E1 = YFGC025WWB: Package: None; Price: None; Value: *; MP: YFGC025WWB; Availability: Unavailable